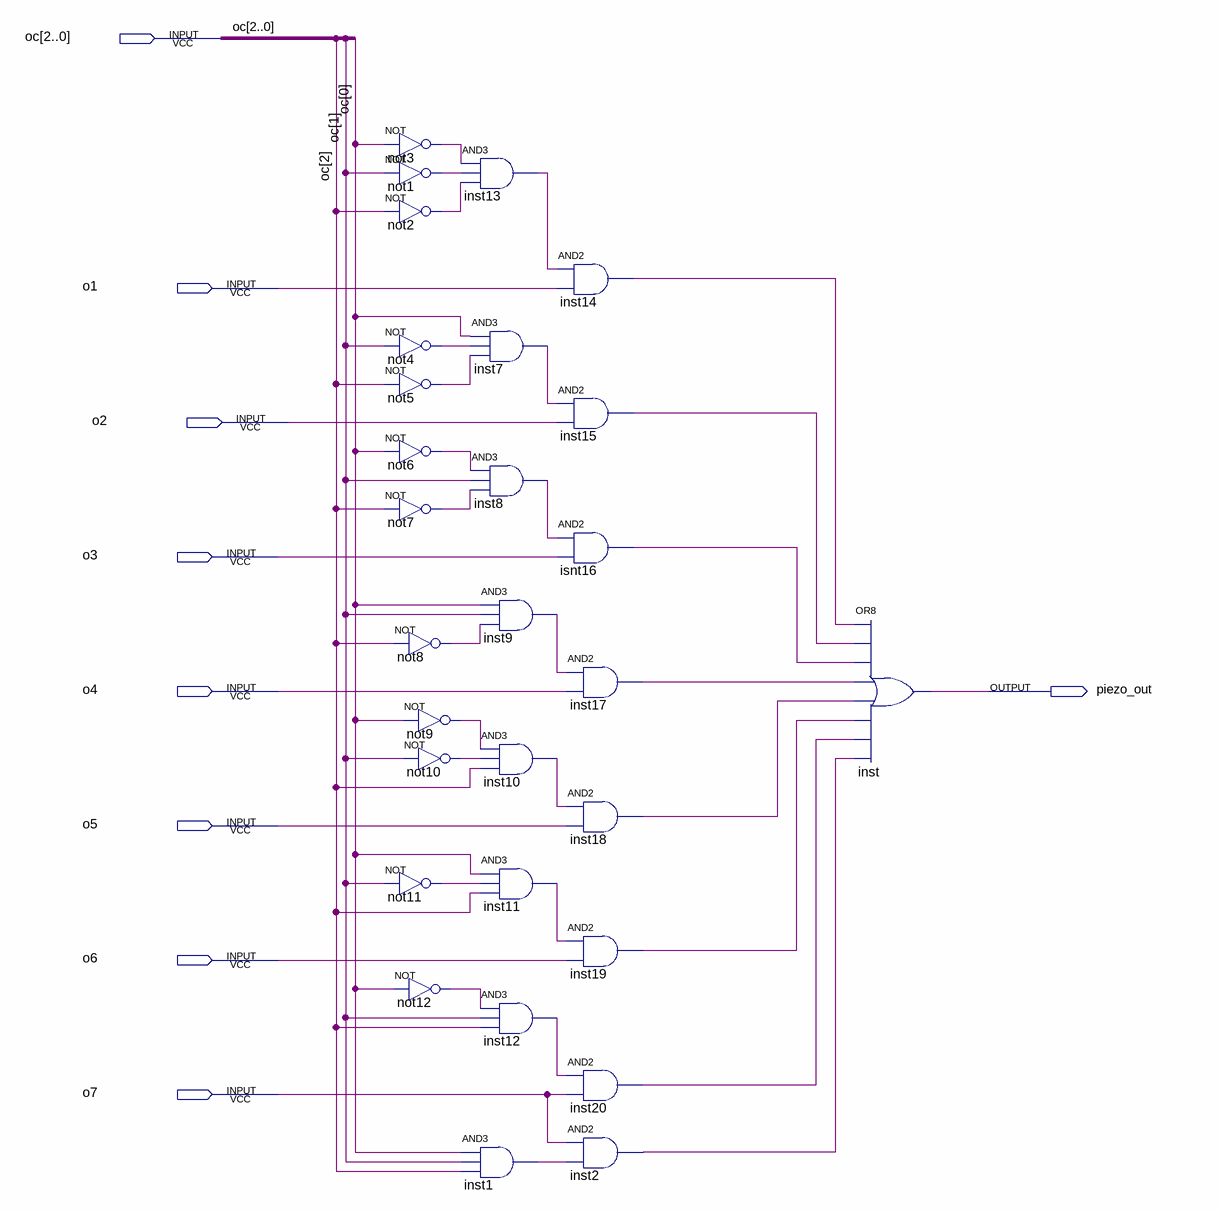
[diagram p0: schematic sheet]
// Quartus schematic piezo_mux.bdf as structural Verilog: 29 symbols, 9 pins
module piezo_mux (
  input  [2:0] oc,
  input  o1,
  input  o2,
  input  o3,
  input  o4,
  input  o5,
  input  o6,
  input  o7,
  output piezo_out
);

  wire inst1_out, inst2_out, inst7_out, inst8_out, inst9_out, inst10_out, inst11_out, inst12_out, inst13_out,
       inst14_out, inst15_out, inst17_out, inst18_out, inst19_out, inst20_out, isnt16_out, not1_out,
       not2_out, not3_out, not4_out, not5_out, not6_out, not7_out, not8_out, not9_out, not10_out, not11_out,
       not12_out;

  not not3 (not3_out, oc[0]);
  not not1 (not1_out, oc[1]);
  not not2 (not2_out, oc[2]);
  not not4 (not4_out, oc[1]);
  not not5 (not5_out, oc[2]);
  not not6 (not6_out, oc[0]);
  not not7 (not7_out, oc[2]);
  not not8 (not8_out, oc[2]);
  not not9 (not9_out, oc[0]);
  not not10 (not10_out, oc[1]);
  not not11 (not11_out, oc[1]);
  not not12 (not12_out, oc[0]);
  and inst13 (inst13_out, not3_out, not1_out, not2_out);
  and inst7 (inst7_out, oc[0], not4_out, not5_out);
  and inst8 (inst8_out, not6_out, oc[1], not7_out);
  and inst9 (inst9_out, oc[0], oc[1], not8_out);
  and inst10 (inst10_out, not9_out, not10_out, oc[2]);
  and inst11 (inst11_out, oc[0], not11_out, oc[2]);
  and inst12 (inst12_out, not12_out, oc[1], oc[2]);
  and inst1 (inst1_out, oc[0], oc[1], oc[2]);
  and inst14 (inst14_out, inst13_out, o1);
  and inst15 (inst15_out, inst7_out, o2);
  and isnt16 (isnt16_out, inst8_out, o3);
  and inst17 (inst17_out, inst9_out, o4);
  and inst18 (inst18_out, inst10_out, o5);
  and inst19 (inst19_out, inst11_out, o6);
  and inst20 (inst20_out, inst12_out, o7);
  and inst2 (inst2_out, o7, inst1_out);
  or inst (piezo_out, inst14_out, inst15_out, isnt16_out, inst17_out, inst18_out, inst19_out, inst20_out, inst2_out);
endmodule
